# Altium schematic sheet Modulo control.SCHDOC
size A3; PageSetup: Record=PageOptions|CenterHorizontal=True|CenterVertical=True|PrintScale=0.50|XCorrection=1.00|YCorrection=1.00|PrintKind=1|BorderSize=5000000|LeftOffset=0|BottomOffset=0|Orientation=1|PaperLength=1000|PaperWidth=1000|Scale=100|PaperSource=7|PrintQuality=-4|MediaType=1|DitherType=10|PaperKind=A4|PrintScaleMode=1
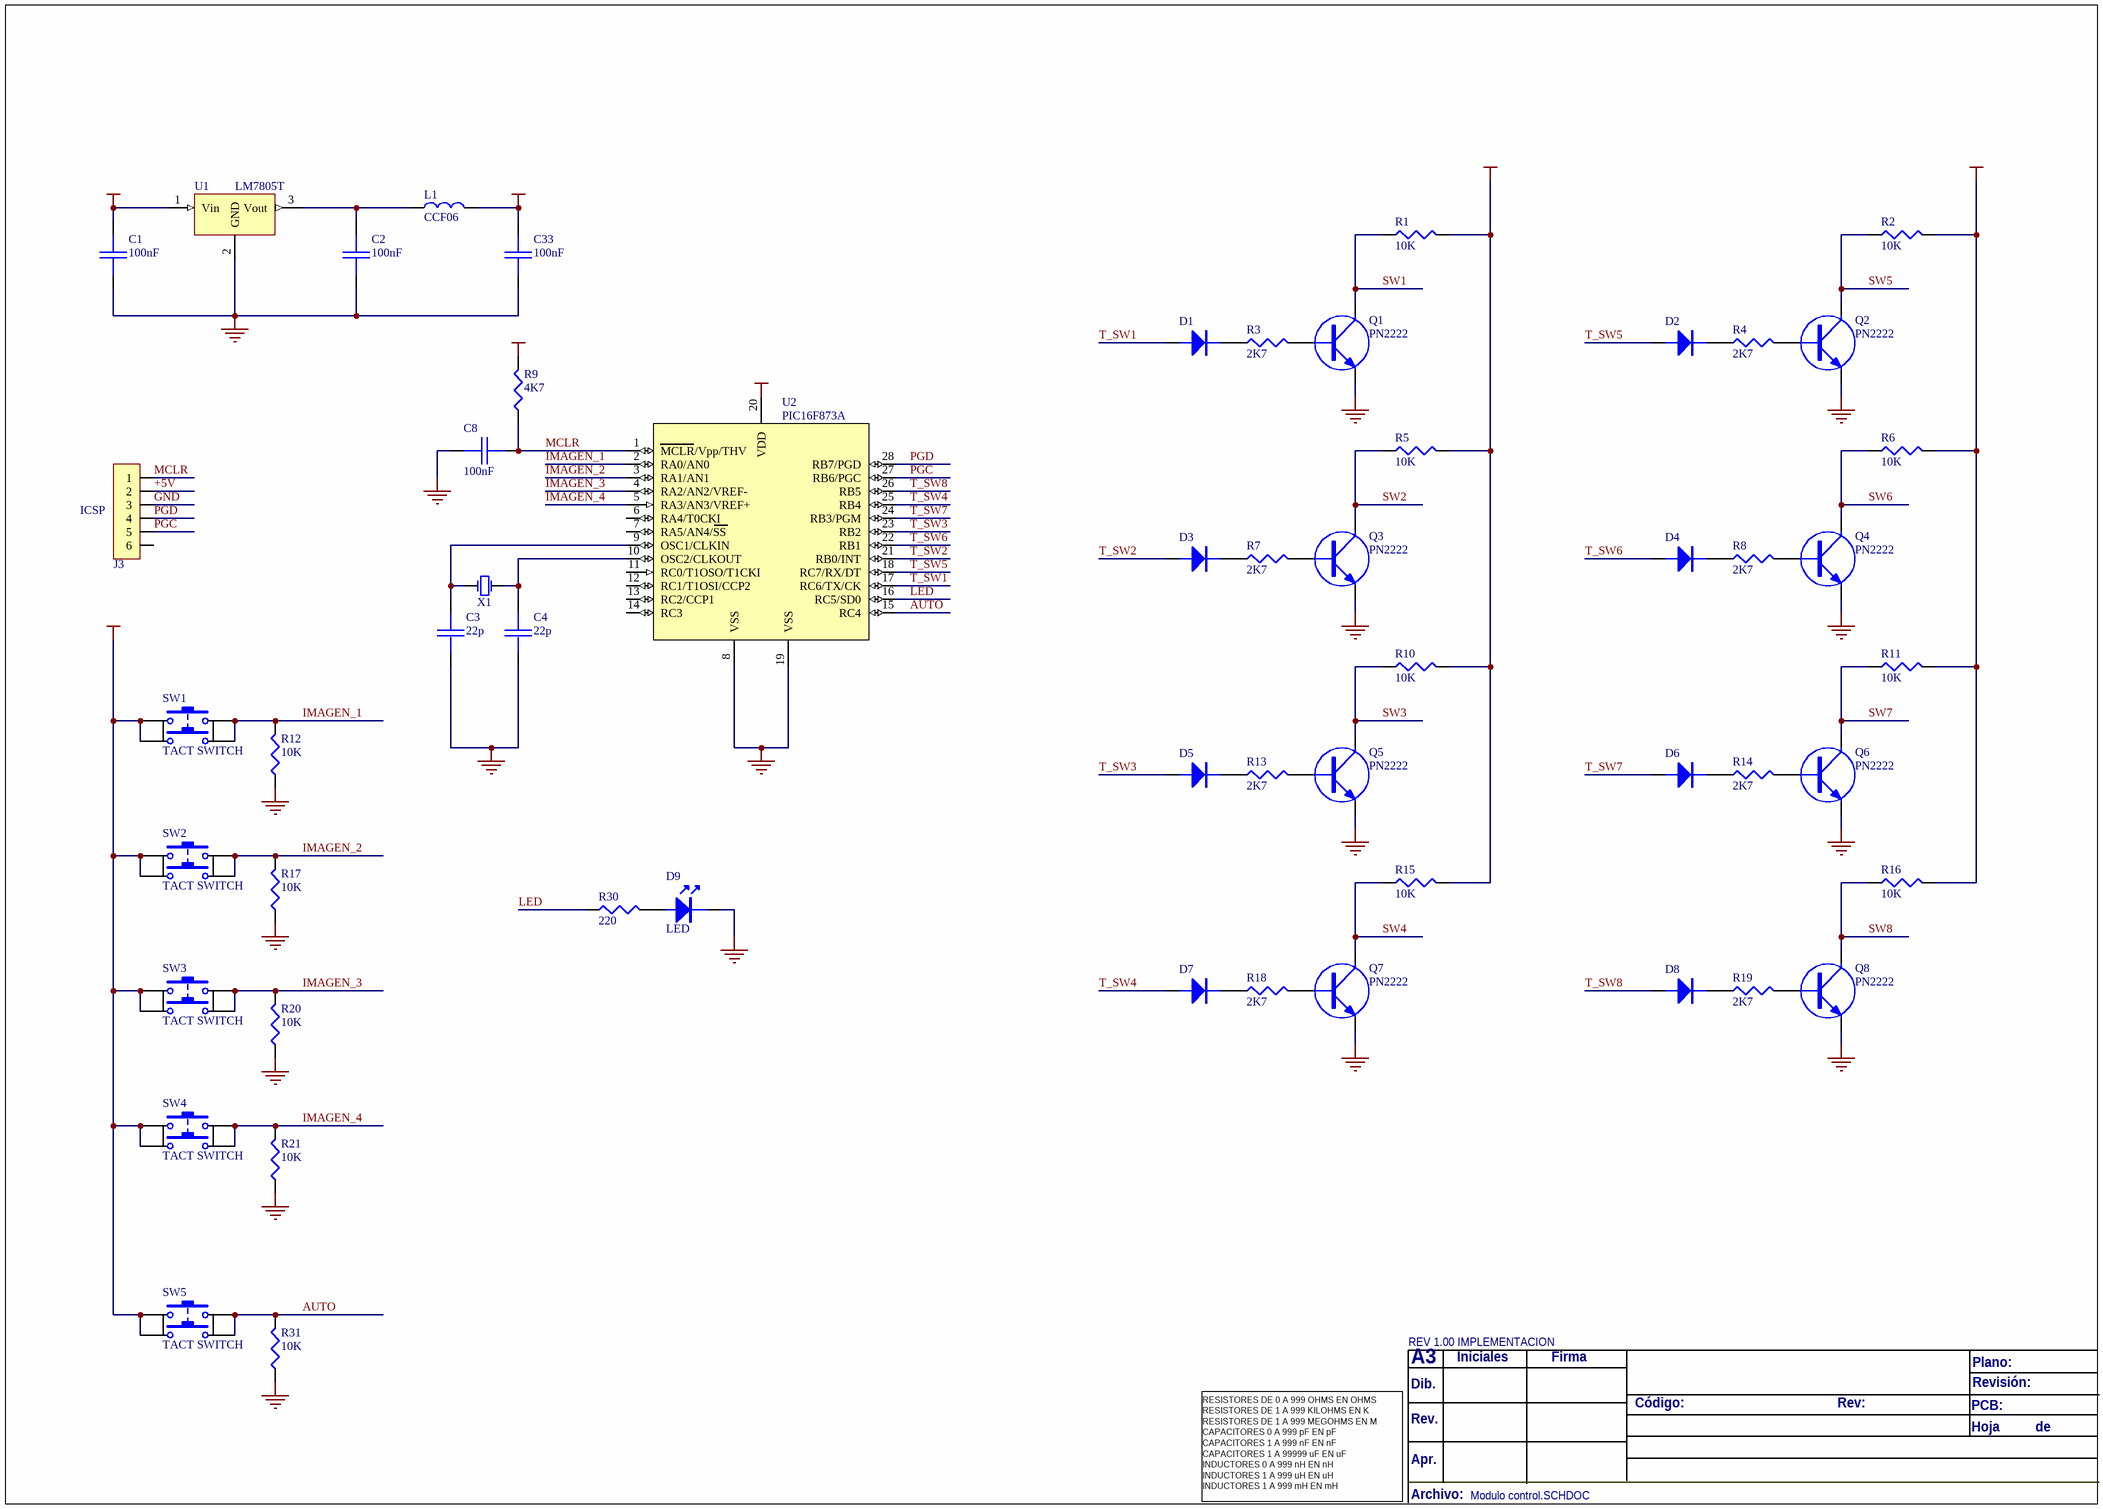
[diagram p0: Modulo control.SCHDOC]

## Parts
C1  100nF  [0805]
C2  100nF  [0805]
C3  22p  [CAP5.08]
C4  22p  [CAP5.08]
C8  100nF  [0805]
C33  100nF  [0805]
D1  1N4148 DO-35  [DO-35_300]  (value not drawn)
D2  1N4148 DO-35  [DO-35_300]  (value not drawn)
D3  1N4148 DO-35  [DO-35_300]  (value not drawn)
D4  1N4148 DO-35  [DO-35_300]  (value not drawn)
D5  1N4148 DO-35  [DO-35_300]  (value not drawn)
D6  1N4148 DO-35  [DO-35_300]  (value not drawn)
D7  1N4148 DO-35  [DO-35_300]  (value not drawn)
D8  1N4148 DO-35  [DO-35_300]  (value not drawn)
D9  LED  [LED 3MM]
J3  HEADER6  [JUMPER_6A]  (value not drawn)
L1  CCF06  [AXIAL10X4_300]
Q1  PN2222  [TO-92C]
Q2  PN2222  [TO-92C]
Q3  PN2222  [TO-92C]
Q4  PN2222  [TO-92C]
Q5  PN2222  [TO-92C]
Q6  PN2222  [TO-92C]
Q7  PN2222  [TO-92C]
Q8  PN2222  [TO-92C]
R1  10K  [RES_MF1/2W_200]
R2  10K  [RES_MF1/2W_200]
R3  2K7  [RES_MF1/2W_200]
R4  2K7  [RES_MF1/2W_200]
R5  10K  [RES_MF1/2W_200]
R6  10K  [RES_MF1/2W_200]
R7  2K7  [RES_MF1/2W_200]
R8  2K7  [RES_MF1/2W_200]
R9  4K7  [RES_MF1/2W_200]
R10  10K  [RES_MF1/2W_200]
R11  10K  [RES_MF1/2W_200]
R12  10K  [RES_MF1/2W_200]
R13  2K7  [RES_MF1/2W_200]
R14  2K7  [RES_MF1/2W_200]
R15  10K  [RES_MF1/2W_200]
R16  10K  [RES_MF1/2W_200]
R17  10K  [RES_MF1/2W_200]
R18  2K7  [RES_MF1/2W_200]
R19  2K7  [RES_MF1/2W_200]
R20  10K  [RES_MF1/2W_200]
R21  10K  [RES_MF1/2W_200]
R30  220  [0805]
R31  10K  [RES_MF1/2W_200]
SW1  TACT SWITCH  [PULSADOR 6X6]
SW2  TACT SWITCH  [PULSADOR 6X6]
SW3  TACT SWITCH  [PULSADOR 6X6]
SW4  TACT SWITCH  [PULSADOR 6X6]
SW5  TACT SWITCH  [PULSADOR 6X6]
U1  LM7805T  [TO-220_1]
U2  PIC16F873A  [DIP28F]
X1  XL20M-UM5  [UM5]  (value not drawn)

## Nets
+5V: C33.1 J3.2 L1.2 R9.2 SW1.1 SW1.3 SW2.1 SW2.3 SW3.1 SW3.3 SW4.1 SW4.3 SW5.1 SW5.3 U2.20(VDD)
GND: C1.2 C2.2 C3.1 C4.1 C8.1 C33.2 D9.K J3.3 Q1.1(E) Q2.1(E) Q3.1(E) Q4.1(E) Q5.1(E) Q6.1(E) Q7.1(E) Q8.1(E) R12.1 R17.1 R20.1 R21.1 R31.1 U1.2(GND) U2.8(VSS) U2.19(VSS)
VCC: C1.1 R1.2 R2.2 R5.2 R6.2 R10.2 R11.2 R15.2 R16.2 U1.1(Vin)
AUTO: R31.2 SW5.2 SW5.4 U2.15(RC4)
IMAGEN_1: R12.2 SW1.2 SW1.4 U2.2(RA0/AN0)
IMAGEN_2: R17.2 SW2.2 SW2.4 U2.3(RA1/AN1)
IMAGEN_3: R20.2 SW3.2 SW3.4 U2.4(RA2/AN2/VREF-)
IMAGEN_4: R21.2 SW4.2 SW4.4 U2.5(RA3/AN3/VREF+)
LED: R30.1 U2.16(RC5/SD0)
MCLR: C8.2 J3.1 R9.1 U2.1(MCLR/Vpp/THV)
PGC: J3.5 U2.27(RB6/PGC)
PGD: J3.4 U2.28(RB7/PGD)
SW1: Q1.3(C) R1.1
SW2: Q3.3(C) R5.1
SW3: Q5.3(C) R10.1
SW4: Q7.3(C) R15.1
SW5: Q2.3(C) R2.1
SW6: Q4.3(C) R6.1
SW7: Q6.3(C) R11.1
SW8: Q8.3(C) R16.1
T_SW1: D1.A U2.17(RC6/TX/CK)
T_SW2: D3.A U2.21(RB0/INT)
T_SW3: D5.A U2.23(RB2)
T_SW4: D7.A U2.25(RB4)
T_SW5: D2.A U2.18(RC7/RX/DT)
T_SW6: D4.A U2.22(RB1)
T_SW7: D6.A U2.24(RB3/PGM)
T_SW8: D8.A U2.26(RB5)
NetC2_1: C2.1 L1.1 U1.3(Vout)
NetC3_2: C3.2 U2.9(OSC1/CLKIN) X1.2(OSC2)
NetC4_2: C4.2 U2.10(OSC2/CLKOUT) X1.1(OSC1)
NetD1_K: D1.K R3.1
NetD2_K: D2.K R4.1
NetD3_K: D3.K R7.1
NetD4_K: D4.K R8.1
NetD5_K: D5.K R13.1
NetD6_K: D6.K R14.1
NetD7_K: D7.K R18.1
NetD8_K: D8.K R19.1
NetD9_A: D9.A R30.2
NetQ1_2: Q1.2(B) R3.2
NetQ2_2: Q2.2(B) R4.2
NetQ3_2: Q3.2(B) R7.2
NetQ4_2: Q4.2(B) R8.2
NetQ5_2: Q5.2(B) R13.2
NetQ6_2: Q6.2(B) R14.2
NetQ7_2: Q7.2(B) R18.2
NetQ8_2: Q8.2(B) R19.2

Not connected (* = marked no-connect by the designer): J3 6; U2 6(RA4/T0CKI) 7(RA5/AN4/SS) 11(RC0/T1OSO/T1CKI) 12(RC1/T1OSI/CCP2) 13(RC2/CCP1) 14(RC3)

## Notes on the sheet
- (near J3) ICSP
- REV 1.00 IMPLEMENTACION
- Dib.
- A3
- Iniciales
- Firma
- Plano:
- Revisión:
- Rev.
- Apr.
- Código:
- Rev:
- Hoja          de
- PCB:
- RESISTORES DE 0 A 999 OHMS EN OHMS
  RESISTORES DE 1 A 999 KILOHMS EN K
  RESISTORES DE 1 A 999 MEGOHMS EN M
  CAPACITORES 0 A 999 pF EN pF
  CAPACITORES 1 A 999 nF EN nF
  CAPACITORES 1 A 99999 uF EN uF
  INDUCTORES 0 A 999 nH EN nH
  INDUCTORES 1 A 999 uH EN uH
  INDUCTORES 1 A 999 mH EN mH
- Archivo:

## Library data of the parts
C1 C2 C8 C33 = 100n: CAPACITOR SMD 0805 X7R  50 V 100 nF; CODIGO: YSBC104AAG
C3 C4 = 22p: CAPACITOR PLATE NP0 100V PASO 2.54 mm 22 pF; CODIGO: YPA0220BAG
D1-D8 = 1N4148 DO-35: 1N4148 DO-35 DIODO; CODIGO: DR00006ABH
D9 = LED AMARILLO 3MM: CODIGO: DLRA030XCG
J3 = HEADER6: TIRA MOLEX 1X6 11MM MACHO RECTA PARA PCB
L1 = CCF06: INDUCTOR CCF06; CODIGO: LC0000003G
Q1-Q8 = PN2222: PN2222 TO-92 NPN TRANSISTOR; CODIGO: QS00001AAG
R1 R2 R5 R6 R10-R12 R15-R17 R20 R21 R31 = 10K: RESISTOR METAL FILM 0.5 W 5% 10 KILOHMS; CODIGO: RMC00103EG
R3 R4 R7 R8 R13 R14 R18 R19 = 2K7: RESISTOR METAL FILM 0.5 W 5% 2.7 KILOHMS; CODIGO: RMC00272EG
R9 = 4K7: RESISTOR METAL FILM 0.5 W 5% 4.7 KILOHMS; CODIGO: RMC00472EG
R30 = 220: RESISTOR SMD0805 0.125 W 5%  220 OHMS; CODIGO: RSB00221EG
SW1-SW5 = SW-PB: TACT SWITCH 6X6X12MM 4PINES TSWTS065; CODIGO: KM0000001H
U1 = LM7805T: LM7805T TO-220 CIRC INT; CODIGO: UV00001EBG
U2 = PIC-16F873A: PIC-16F873A - I/SP DIP28 7.62 MM; CODIGO: UI00001AMG
X1 = XL20M-UM5: XL20M-UM5 CRISTAL DE 20 MHZ 10ppm; CODIGO: XXAC00012H